# Altium schematic sheet Schematic.SchDoc: Gyroscope Module Circuit
size A4; Organization: Altium Limited; Address1: L3, 12a Rodborough Rd; Address2: Frenchs Forest; Address3: NSW; Address4: Australia 2086; DocumentNumber: 1; Revision: V1.0; SheetNumber: 1; SheetTotal: 1
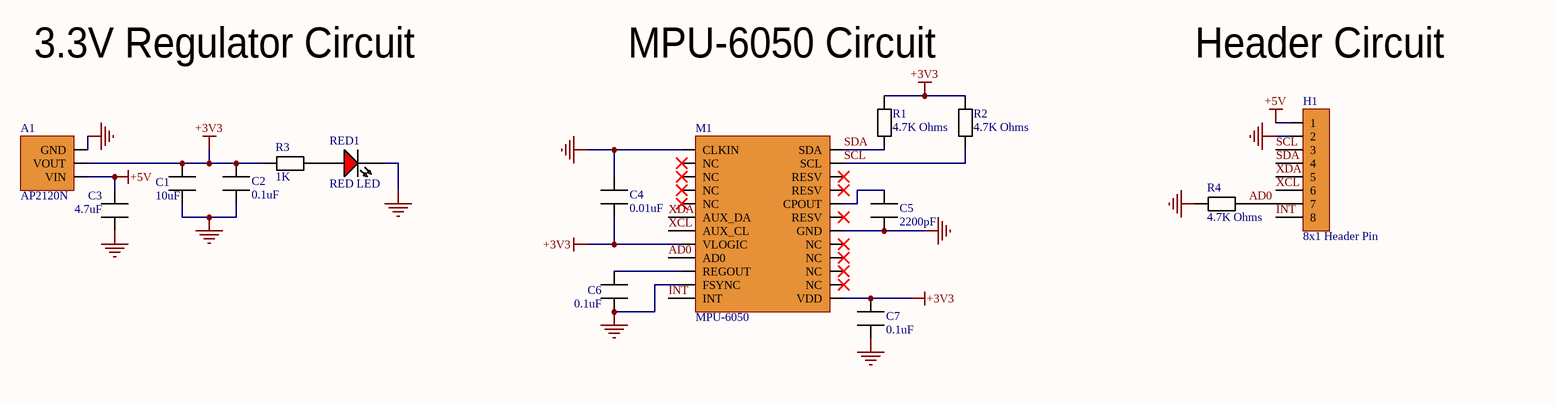
[diagram p0: Schematic.SchDoc]

## Parts
A1  AP2120N  [AP2120N]
C1  10uF  [10uF Capacitor]
C2  0.1uF  [0.1uF]
C3  4.7uF  [4.7uF Capacitor]
C4  0.01uF  [0.01uF Capacitor]
C5  2200pF  [2200pF Capacitor]
C6  0.1uF  [0.1uF]
C7  0.1uF  [0.1uF]
H1  8x1 Header Pin  [8x1 Header Pin]
M1  MPU-6050  [MPU-6050]
R1  4.7K Ohms  [4.7K Resistor]
R2  4.7K Ohms  [4.7K Resistor]
R3  1K  [1K Resistor]
R4  4.7K Ohms  [4.7K Resistor]
RED1  RED LED  [Red LED]

## Nets
+3V3: A1.2(VOUT) C1.2 C2.2 C4.1 C7.2 M1.8(VLOGIC) M1.13(VDD) R1.2 R2.2 R3.1
+5V: A1.3(VIN) C3.2 H1.1
GND: A1.1(GND) C1.1 C2.1 C3.1 C4.2 C5.1 C6.1 C7.1 H1.2 M1.1(CLKIN) M1.11(FSYNC) M1.18(GND) R4.1 RED1.1
AD0: H1.7 M1.9(AD0) R4.2
INT: H1.8 M1.12(INT)
SCL: H1.3 M1.23(SCL) R2.1
SDA: H1.4 M1.24(SDA) R1.1
XCL: H1.6 M1.7(AUX_CL)
XDA: H1.5 M1.6(AUX_DA)
NetC5_2: C5.2 M1.20(CPOUT)
NetC6_2: C6.2 M1.10(REGOUT)
NetR3_2: R3.2 RED1.2

Not connected (* = marked no-connect by the designer): M1 2(NC)* 3(NC)* 4(NC)* 5(NC)* 14(NC)* 15(NC)* 16(NC)* 17(NC)* 19(RESV)* 21(RESV)* 22(RESV)*

## Notes on the sheet
- 3.3V Regulator Circuit
- MPU-6050 Circuit
- Header Circuit
- Title
- Size:
- Date:
- A4
- Number:
- Time:
- Revision:
- Sheet
- of
- File:

## Library data of the parts
A1 = AP2120N-3.3TRG1: IC REG LINEAR 3.3V 150MA SOT23; Manufacturer: Diodes; Dropout Voltage: 300mV; Number of Outputs: 1; Min Input Voltage: 2V; Max Input Voltage: 6V; Quiescent Current: 50uA; Polarity: Positive; Accuracy: 2%; Operating Supply Current: 25uA; Power Supply Rejection Ratio (PSRR): 65dB; Output Type: Fixed; Supplier 1: Digi-Key; Manufacturer Part Number: AP2120N-3.3TRG1; RoHS: Yes; Category: Voltage Regulators - Linear; Stock 1: 110843; Pricing 1: 1=0.36000, 10=0.26700, 25=0.23400, 100=0.13370, 250=0.12536, 500=0.10030, 1000=0.07689 (USD); Mount: Surface Mount; Case/Package: SOT-23; Number of Pins: 3; Weight: 0.000282oz; Min Operating Temperature: -40°C; Max Operating Temperature: 85°C; Package Quantity: 3000; Packaging: Tape and Reel; Output Voltage: 3.3V; Output Current: 150mA; Number of Regulators: 1; Max Output Current: 150mA; Length: 3mm; Width: 1.4mm; Height: 1.1mm; Radiation Hardening: No; Lead Free: Lead Free; ComponentLink1URL: https://datasheet.ciiva.com/29569/ap2120-29569977.pdf?src-supplier=Digi-Key; ComponentLink1Description: https://datasheet.ciiva.com/29569/ap2120-29569977.pdf?src-supplier=Digi-Key; ComponentLink2URL: https://datasheet.ciiva.com/30016/ap2120-30016809.pdf?src-supplier=Avnet; ComponentLink2Description: https://datasheet.ciiva.com/30016/ap2120-30016809.pdf?src-supplier=Avnet; ComponentLink3URL: https://datasheet.ciiva.com/29569/ap2120-29569978.pdf?src-supplier=Digi-Key; ComponentLink3Description: https://datasheet.ciiva.com/29569/ap2120-29569978.pdf?src-supplier=Digi-Key; ComponentLink4URL: https://datasheet.ciiva.com/29569/ap2120-29569979.pdf?src-supplier=Digi-Key; ComponentLink4Description: https://datasheet.ciiva.com/29569/ap2120-29569979.pdf?src-supplier=Digi-Key; Supplier Part Number 1: AP2120N-3.3TRG1DICT-ND
C1 = GRM21BR71A106KA73K: Cap Ceramic 10uF 10V X7R 10% Pad SMD 0805 125C T/R; Manufacturer: Murata; Supplier 1: Digi-Key; Manufacturer Part Number: GRM21BR71A106KA73K; RoHS: No; Category: Ceramic Capacitors; Stock 1: 325088; Pricing 1: 1=0.19000, 10=0.12700, 50=0.07620, 100=0.06440, 500=0.04404, 1000=0.03896, 2500=0.03727, 5000=0.03388 (USD); Case/Package: 0805; Voltage Rating (DC): 10V; Dielectric: X7R; Tolerance: 10%; Capacitance: 10uF; Length: 2mm; Width: 1.25mm; Thickness: 1.25mm; ComponentLink1URL: http://search.murata.co.jp/Ceramy/image/img/A01X/G101/ENG/GRM21BR71A106KA73-01.pdf?src-supplier=Digi-Key; ComponentLink1Description: http://search.murata.co.jp/Ceramy/image/img/A01X/G101/ENG/GRM21BR71A106KA73-01.pdf?src-supplier=Digi-Key; Supplier Part Number 1: 490-14381-1-ND
C2 C6 C7 = GCM21BR72A104KA37L: CAP CER 0.1UF 100V X7R 0805; Manufacturer: Murata; Capacitance: 100nF; Tolerance: 10%; Supplier 1: Digi-Key; Manufacturer Part Number: GCM21BR72A104KA37L; RoHS: Yes; Category: Ceramic Capacitors; Stock 1: 11174853; Pricing 1: 1=0.28000, 10=0.19000, 50=0.12680, 100=0.10770, 500=0.07606, 1000=0.06655 (USD); Mount: Surface Mount; Case/Package: 0805; Case Code (Metric): 2012; Case Code (Imperial): 0805; Min Operating Temperature: -55°C; Max Operating Temperature: 125°C; Package Quantity: 1; Packaging: Tape and Reel; Termination: SMD/SMT; Voltage Rating: 100V; Dielectric: X7R; Voltage Rating (DC): 100V; Voltage: 100V; Length: 2mm; Width: 0.049inch; Height: 1.25mm; Depth: 1.25mm; Thickness: 0.055inch; Ratings: AEC-Q200; Radiation Hardening: No; REACH SVHC: No SVHC; Lead Free: Lead Free; ComponentLink1URL: https://datasheet.ciiva.com/2989/product-2989248.pdf?src-supplier=Avnet; ComponentLink1Description: https://datasheet.ciiva.com/2989/product-2989248.pdf?src-supplier=Avnet; ComponentLink2URL: https://datasheet.ciiva.com/18183/getdatasheetpartid-248062-18183712.pdf?src-supplier=Verical; ComponentLink2Description: https://datasheet.ciiva.com/18183/getdatasheetpartid-248062-18183712.pdf?src-supplier=Verical; ComponentLink3URL: https://datasheet.ciiva.com/11786/0900766b80ef92d0-11786205.pdf?src-supplier=RSComponents; ComponentLink3Description: https://datasheet.ciiva.com/11786/0900766b80ef92d0-11786205.pdf?src-supplier=RSComponents; ComponentLink4URL: https://datasheet.ciiva.com/135/product-135646.pdf?src-supplier=Digi-Key; ComponentLink4Description: https://datasheet.ciiva.com/135/product-135646.pdf?src-supplier=Digi-Key; ComponentLink5URL: https://datasheet.ciiva.com/135/product-135647.pdf?src-supplier=Digi-Key; ComponentLink5Description: https://datasheet.ciiva.com/135/product-135647.pdf?src-supplier=Digi-Key; ComponentLink6URL: https://datasheet.ciiva.com/135/product-135648.pdf?src-supplier=Digi-Key; ComponentLink6Description: https://datasheet.ciiva.com/135/product-135648.pdf?src-supplier=Digi-Key; ComponentLink7URL: https://datasheet.ciiva.com/48671/product-48671358.pdf?src-supplier=Avnet; ComponentLink7Description: https://datasheet.ciiva.com/48671/product-48671358.pdf?src-supplier=Avnet; ComponentLink8URL: https://datasheet.ciiva.com/16449/product-16449295.pdf?src-supplier=Future+Electronics; ComponentLink8Description: https://datasheet.ciiva.com/16449/product-16449295.pdf?src-supplier=Future+Electronics; Supplier Part Number 1: 490-4789-1-ND
C3 = GRM21BR71C475KE51L: Capacitor: ceramic; 4.7uF; 16V; X7R; ±10%; SMD; 0805; Series: GRM; Manufacturer: Murata; Supplier 1: Digi-Key; Manufacturer Part Number: GRM21BR71C475KE51L; RoHS: No; Category: Ceramic Capacitors; Stock 1: 188751; Pricing 1: 1=0.19000, 10=0.13500, 50=0.07680, 100=0.06360, 500=0.04462, 1000=0.03694 (USD); Case/Package: 0805; Capacitance: 4.7uF; Tolerance: 10%; Dielectric: X7R; Voltage Rating (DC): 16V; Length: 2mm; Width: 1.25mm; Thickness: 1.25mm; ComponentLink1URL: http://www.farnell.com/datasheets/2189142.pdf?src-supplier=Farnell; ComponentLink1Description: http://www.farnell.com/datasheets/2189142.pdf?src-supplier=Farnell; ComponentLink2URL: http://search.murata.co.jp/Ceramy/image/img/A01X/G101/ENG/GRM21BR71C475KE51-01.pdf?src-supplier=Digi-Key; ComponentLink2Description: http://search.murata.co.jp/Ceramy/image/img/A01X/G101/ENG/GRM21BR71C475KE51-01.pdf?src-supplier=Digi-Key; Supplier Part Number 1: 490-14466-1-ND
C4 = GCJ21BR72E103KXJ3L: MURATA   GCJ21BR72E103KXJ3L   CAP, MLCC, X7R, 10NF, 250V, 0805; Tolerance: 10%; Supplier 1: Digi-Key; Manufacturer: Murata; Manufacturer Part Number: GCJ21BR72E103KXJ3L; RoHS: Yes; Category: Ceramic Capacitors; Stock 1: 32179; Pricing 1: 1=0.29000, 10=0.20200, 50=0.13440, 100=0.11420, 500=0.08064, 1000=0.07056 (USD); Mount: Surface Mount; Case/Package: 0805; Case Code (Imperial): 0805; Case Code (Metric): 2012; Min Operating Temperature: -55°C; Max Operating Temperature: 125°C; Capacitance: 10nF; Voltage Rating: 250V; Packaging: Tape and Reel; Package Quantity: 3000; Dielectric: X7R; Termination: SMD/SMT; Voltage Rating (DC): 250V; Features: Soft Termination; Length: 0.079inch; Width: 0.049inch; Thickness: 0.057inch; Ratings: AEC-Q200; REACH SVHC: No SVHC; ComponentLink1URL: https://datasheet.ciiva.com/136/s0717e-136341.pdf?src-supplier=Digi-Key; ComponentLink1Description: https://datasheet.ciiva.com/136/s0717e-136341.pdf?src-supplier=Digi-Key; ComponentLink2URL: https://datasheet.ciiva.com/136/s0717e-136342.pdf?src-supplier=Digi-Key; ComponentLink2Description: https://datasheet.ciiva.com/136/s0717e-136342.pdf?src-supplier=Digi-Key; ComponentLink3URL: https://datasheet.ciiva.com/136/s0717e-136343.pdf?src-supplier=Digi-Key; ComponentLink3Description: https://datasheet.ciiva.com/136/s0717e-136343.pdf?src-supplier=Digi-Key; ComponentLink4URL: https://datasheet.ciiva.com/22698/1666661-22698366.pdf?src-supplier=Element14; ComponentLink4Description: https://datasheet.ciiva.com/22698/1666661-22698366.pdf?src-supplier=Element14; Supplier Part Number 1: 490-5595-1-ND
C5 = GRM2165C2A222JA01D: Multilayer Ceramic Capacitors MLCC - SMD/SMT 0805 2200pF 100volt C0G +/-5%; Manufacturer: Murata; Capacitance: 2.2nF; Tolerance: 5%; Voltage Rating: 100V; Supplier 1: Digi-Key; Manufacturer Part Number: GRM2165C2A222JA01D; RoHS: Yes; Category: Ceramic Capacitors; Stock 1: 68525; Pricing 1: 1=0.22000, 10=0.14900, 50=0.08960, 100=0.07570, 500=0.05176, 1000=0.04579 (USD); Mount: Surface Mount; Case/Package: 0805; Case Code (Imperial): 0805; Case Code (Metric): 2012; Min Operating Temperature: -55°C; Max Operating Temperature: 125°C; Packaging: Tape and Reel; Package Quantity: 4000; Dielectric: C0G; Termination: SMD/SMT; Voltage Rating (DC): 100V; Length: 2mm; Width: 0.049inch; Height: 0.6mm; Thickness: 0.028inch; Depth: 1.25mm; Radiation Hardening: No; ComponentLink1URL: https://datasheet.ciiva.com/5417/product-5417110.pdf?src-supplier=Mouser; ComponentLink1Description: https://datasheet.ciiva.com/5417/product-5417110.pdf?src-supplier=Mouser; ComponentLink2URL: https://datasheet.ciiva.com/6270/partnumbering-e-01-6270474.pdf?src-supplier=Digi-Key; ComponentLink2Description: https://datasheet.ciiva.com/6270/partnumbering-e-01-6270474.pdf?src-supplier=Digi-Key; ComponentLink3URL: https://datasheet.ciiva.com/6270/partnumbering-e-01-6270475.pdf?src-supplier=Digi-Key; ComponentLink3Description: https://datasheet.ciiva.com/6270/partnumbering-e-01-6270475.pdf?src-supplier=Digi-Key; ComponentLink4URL: https://datasheet.ciiva.com/6270/partnumbering-e-01-6270476.pdf?src-supplier=Digi-Key; ComponentLink4Description: https://datasheet.ciiva.com/6270/partnumbering-e-01-6270476.pdf?src-supplier=Digi-Key; Supplier Part Number 1: 490-6448-1-ND
H1 = 61300811121: Board-To-Board Connector, Vertical, Wr-Phd Series, Through Hole, Header, 8, 2.54 Mm; Manufacturer: Wurth Electronics; Number of Positions: 8; Gender: Male; Connector Type: Male Pin; Pitch: 0.1inch; Supplier 1: Digi-Key; Manufacturer Part Number: 61300811121; RoHS: Yes; Category: Connectors; Stock 1: 16067; Pricing 1: 1=0.37000, 10=0.31500, 25=0.26320, 50=0.21900, 100=0.19900, 1000=0.18100 (USD); Mount: Through Hole; Contact Plating: Gold; Contact Material: Copper; Color: Black; Number of Rows: 1; Packaging: Bulk; Termination: Solder; Number of Contacts: 8; Contact Mating Length: 0.236inch; REACH SVHC: Unknown; ComponentLink1URL: http://www.farnell.com/cad/1737268.pdf?src-supplier=Element14; ComponentLink1Description: http://www.farnell.com/cad/1737268.pdf?src-supplier=Element14; ComponentLink2URL: https://katalog.we-online.de/em/datasheet/6130xx11121.pdf?src-supplier=Digi-Key; ComponentLink2Description: https://katalog.we-online.de/em/datasheet/6130xx11121.pdf?src-supplier=Digi-Key; Supplier Part Number 1: 732-5321-ND
M1 = MPU-6050: INVENSENSE   MPU-6050   GYRO / ACCEL, 6-AXIS, I2C, QFN-24; Manufacturer: TDK InvenSense; Sensor Type: Accelerometer,Gyroscope,3 Axis; Supplier 1: Digi-Key; Manufacturer Part Number: MPU-6050; RoHS: Yes; Category: Inertial Measurement Units (IMUs); Stock 1: 7274; Pricing 1: 1=7.55000, 5=6.62600, 10=5.96300, 25=5.30000, 50=4.90260, 100=4.24000, 500=3.97500, 1000=3.71000 (USD); Mount: Surface Mount; Case/Package: QFN; Min Operating Temperature: -40°C; Max Operating Temperature: 85°C; Packaging: Tape and Reel; Output Type: I2C; ComponentLink1URL: https://datasheet.ciiva.com/1513/1788002-1513632.pdf?src-supplier=Element14; ComponentLink1Description: https://datasheet.ciiva.com/1513/1788002-1513632.pdf?src-supplier=Element14; ComponentLink2URL: https://datasheet.ciiva.com/22731/1788002-22731434.pdf?src-supplier=Element14; ComponentLink2Description: https://datasheet.ciiva.com/22731/1788002-22731434.pdf?src-supplier=Element14; Supplier Part Number 1: 1428-1007-1-ND
R1 R2 R4 = RNCP0805FTD4R70: RES SMD 4.7 OHM 1% 1/4W 0805; Manufacturer: Stackpole Electronics; Resistance: 4.7R; Max Power Dissipation: 250mW; Temperature Coefficient: 100ppm/°C; Supplier 1: Digi-Key; Manufacturer Part Number: RNCP0805FTD4R70; RoHS: Yes; Category: Chip SMD Resistors; Stock 1: 22011; Pricing 1: 1=0.10000, 10=0.07000, 100=0.02830, 1000=0.01272, 2500=0.01104 (USD); Mount: Surface Mount; Case/Package: 0805; Case Code (Metric): 2012; Case Code (Imperial): 0805; Min Operating Temperature: -55°C; Max Operating Temperature: 155°C; Packaging: Tape and Reel; Resistor Type: Thin Film; Number of Terminations: 2; Tolerance: 1%; Features: Moisture Resistant,Anti-Sulfur; Length: 0.079inch; Width: 0.049inch; Height: 0.024inch; ComponentLink1URL: http://www.seielect.com/Catalog/SEI-rncp.pdf?src-supplier=Digi-Key; ComponentLink1Description: http://www.seielect.com/Catalog/SEI-rncp.pdf?src-supplier=Digi-Key; ComponentLink2URL: https://www.seielect.com/catalog/SEI-Packaging.pdf?src-supplier=Digi-Key; ComponentLink2Description: https://www.seielect.com/catalog/SEI-Packaging.pdf?src-supplier=Digi-Key; Supplier Part Number 1: RNCP0805FTD4R70CT-ND
R3 = RNCP0805FTD1K00: RES 1K OHM 1% 1/4W 0805; Manufacturer: Stackpole Electronics; Max Power Dissipation: 250mW; Temperature Coefficient: 100ppm/°C; Resistance: 1kR; Supplier 1: Digi-Key; Manufacturer Part Number: RNCP0805FTD1K00; RoHS: Yes; Category: Chip SMD Resistors; Stock 1: 271680; Pricing 1: 1=0.10000, 10=0.07000, 100=0.02830, 1000=0.01272, 2500=0.01104 (USD); Mount: Surface Mount; Case/Package: 0805; Case Code (Metric): 2012; Case Code (Imperial): 0805; Min Operating Temperature: -55°C; Max Operating Temperature: 155°C; Features: Moisture Resistant,Anti-Sulfur; Resistor Type: Thin Film; Number of Terminations: 2; Tolerance: 1%; Power Rating: 250mW; Packaging: Tape and Reel; Length: 0.079inch; Width: 0.049inch; Height: 0.024inch; Lead Free: Lead Free; ComponentLink1URL: http://www.seielect.com/Catalog/SEI-rncp.pdf?src-supplier=Future+Electronics; ComponentLink1Description: http://www.seielect.com/Catalog/SEI-rncp.pdf?src-supplier=Future+Electronics; ComponentLink2URL: https://www.seielect.com/catalog/SEI-Packaging.pdf?src-supplier=Digi-Key; ComponentLink2Description: https://www.seielect.com/catalog/SEI-Packaging.pdf?src-supplier=Digi-Key; ComponentLink3URL: https://www.seielect.com/Catalog/SEI-rncp.pdf?src-supplier=Digi-Key; ComponentLink3Description: https://www.seielect.com/Catalog/SEI-rncp.pdf?src-supplier=Digi-Key; Supplier Part Number 1: RNCP0805FTD1K00CT-ND
RED1 = 150080RS75000: SMD LED red 2.4 V 0805, 150080RS75000, Würth Elektronik; Manufacturer: Wurth Electronics; Luminous Intensity: 150mcd; Viewing Angle: 140°; Forward Voltage: 2V; Wavelength: 625nm; Lens Style: Clear,Rectangular; Forward Current: 30mA; Test Current: 20mA; Supplier 1: Digi-Key; Manufacturer Part Number: 150080RS75000; RoHS: Yes; Category: LEDs; Stock 1: 43201; Pricing 1: 1=0.18000, 50=0.16500, 100=0.14200, 500=0.12300 (USD); Mount: Surface Mount; Case/Package: 0805; Color: Red; Case Code (Metric): 2012; Case Code (Imperial): 0805; Min Operating Temperature: -40°C; Max Operating Temperature: 85°C; Package Quantity: 4000; Packaging: Tape and Reel; Dominant Wavelength: 625nm; Length: 2mm; Width: 1.25mm; Height: 0.7mm; REACH SVHC: Unknown; ComponentLink1URL: https://datasheet.ciiva.com/22656/150080rs75000-22656961.pdf?src-supplier=Element14; ComponentLink1Description: https://datasheet.ciiva.com/22656/150080rs75000-22656961.pdf?src-supplier=Element14; ComponentLink2URL: https://datasheet.ciiva.com/29279/759435-da-01-en-chipled-0805-w-kl-rot-150080rs75000-29279032.pdf?src-supplier=Conrad; ComponentLink2Description: https://datasheet.ciiva.com/29279/759435-da-01-en-chipled-0805-w-kl-rot-150080rs75000-29279032.pdf?src-supplier=Conrad; Supplier Part Number 1: 732-4984-1-ND